# Altium project MC.PrjPcb
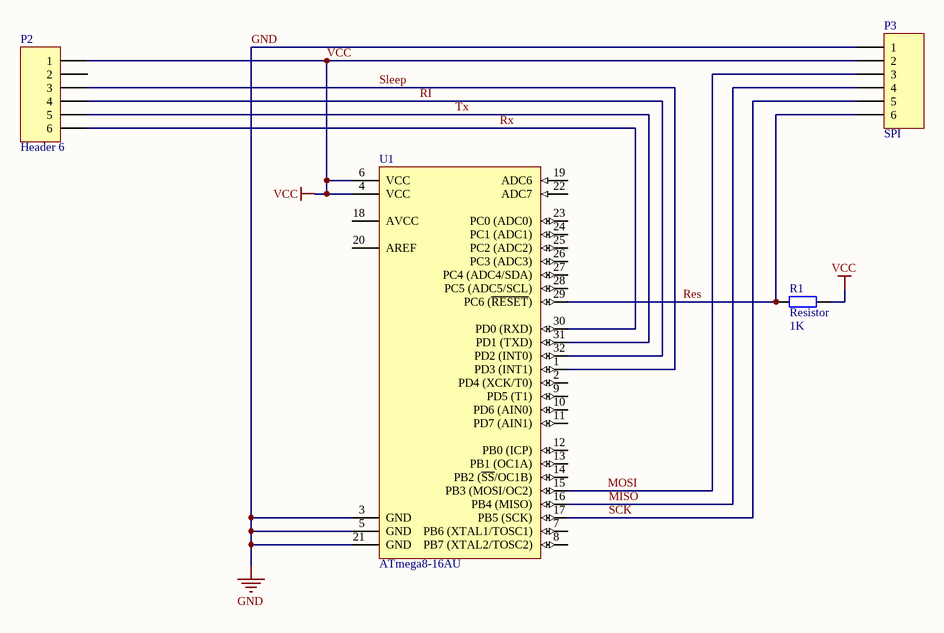
[diagram p0: AtMega8.SchDoc]
1 sheet, 4 parts. Net scope: global (net labels, ports and power ports of the same name join across sheets).
Board files: AtMega8.PcbDoc, Panel.PcbDoc

## Sheet AtMega8.SchDoc
size A4

### Parts
P2  Header 6  [HDR1X6]
P3  SPI  [HDR1X6]
R1  Resistor  value 1K  [RESC(0805)2112X05N_wave]
U1  ATmega8-16AU  [32A_N]

### Nets
GND: P3.1 U1.3(GND) U1.5(GND) U1.21(GND)
VCC: P2.1 P3.2 R1.2 U1.4(VCC) U1.6(VCC)
MISO: P3.4 U1.16(PB4_(MISO))
MOSI: P3.3 U1.15(PB3_(MOSI/OC2))
Res: P3.6 R1.1 U1.29(PC6_(~{RESET}))
RI: P2.4 U1.32(PD2_(INT0))
Rx: P2.6 U1.30(PD0_(RXD))
SCK: P3.5 U1.17(PB5_(SCK))
Sleep: P2.3 U1.1(PD3_(INT1))
Tx: P2.5 U1.31(PD1_(TXD))

Not connected (* = marked no-connect by the designer): P2 2; U1 2(PD4_(XCK/T0)) 7(PB6_(XTAL1/TOSC1)) 8(PB7_(XTAL2/TOSC2)) 9(PD5_(T1)) 10(PD6_(AIN0)) 11(PD7_(AIN1)) 12(PB0_(ICP)) 13(PB1_(OC1A)) 14(PB2_(~{SS}/OC1B)) 18(AVCC) 19(ADC6) 20(AREF) 22(ADC7) 23(PC0_(ADC0)) 24(PC1_(ADC1)) 25(PC2_(ADC2)) 26(PC3_(ADC3)) 27(PC4_(ADC4/SDA)) 28(PC5_(ADC5/SCL))

### Library data of the parts
P2 P3 = Header 6: Header, 6-Pin; LatestRevisionDate: 17-Jul-2002; LatestRevisionNote: Re-released for DXP Platform.; Publisher: Altium Limited
U1 = ATmega8-16AU: 8-bit AVR Microcontroller, 4.5-5.5V, 16MHz, 8KB Flash, 512 Bytes EEPROM, 1KB SRAM, 32-pin TQFP, Industrial Grade (-40°C to 85°C); DatasheetVersion: revZ, Feb-2011; PackageVersion: revC, Oct-2010; PackageReference: 32A; PackageDescription: 32-Lead, 7x7x1.0 mm Body, 0.8mm Lead Pitch, Thin Profile Plastic Quad Flat Package (TQFP); Code_JEDEC: MS-026-ABA; ComponentLink1Description: Manufacturer URL; ComponentLink1URL: http://www.atmel.com/; ComponentLink2Description: ATmega8(L); ComponentLink2URL: http://www.atmel.com/dyn/resources/prod_documents/doc2486.pdf; ComponentLink3Description: ATmega8(L) Summary; ComponentLink3URL: http://www.atmel.com/dyn/resources/prod_documents/2486S.pdf